# Altium schematic sheet FTDI.SchDoc: FTDI
size A4; Date: 30.05.2015; Author: G. Gajoch, M. Gumiela; DocumentNumber: 9; SheetNumber: 9; SheetTotal: 9; Model: EM1; PageSetup: Record=PageOptions|CenterHorizontal=True|CenterVertical=True|PrintScale=0.52|XCorrection=1.00|YCorrection=1.00|PrintKind=1|BorderSize=5000000|LeftOffset=0|BottomOffset=0|Orientation=2|PaperLength=4200|PaperWidth=2970|Scale=100|PaperSource=7|PrintQuality=600|MediaType=1|DitherType=10|PaperKind=A3|PrintScaleMode=1
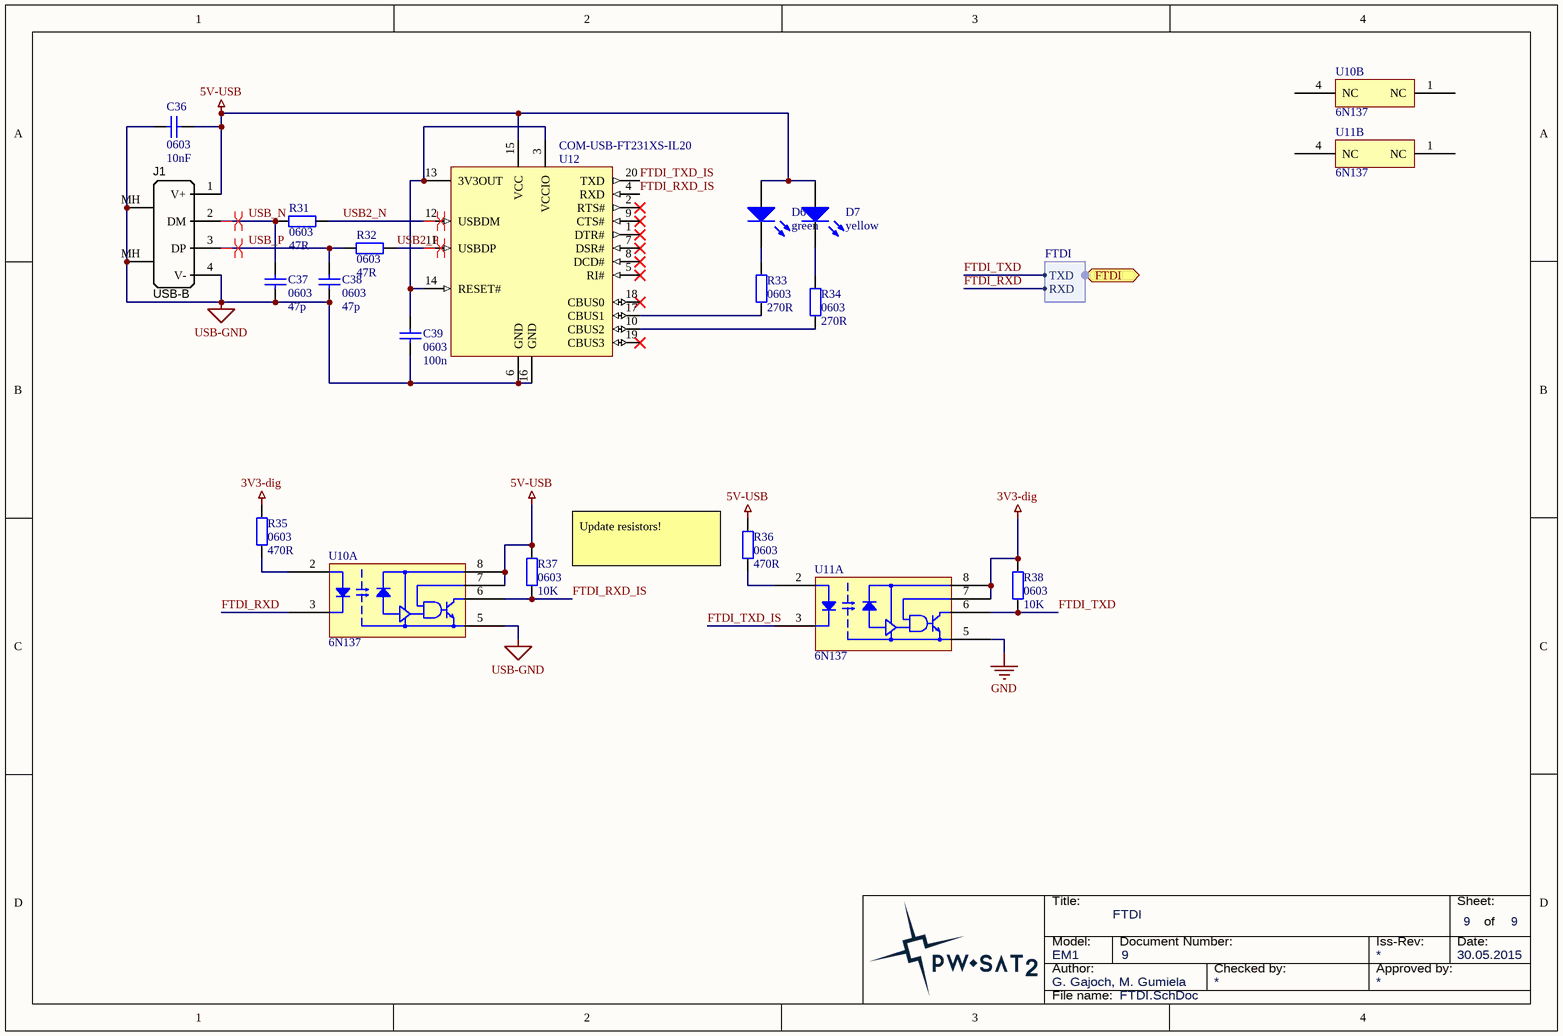
[diagram p0: FTDI.SchDoc]

## Parts
C36  0603  value 10nF  [SMD_Capacitor_0603]
C37  0603  value 47p  [SMD_Capacitor_0603]
C38  0603  value 47p  [SMD_Capacitor_0603]
C39  0603  value 100n  [SMD_Capacitor_0603]
D6  green  [LED 0805 GREEN]
D7  yellow  [LED 0805 Yellow]
J1  USB-B  [USB_TypeB_Tyco]
R31  0603  value 47R  [SMD_Resistor_0603]
R32  0603  value 47R  [SMD_Resistor_0603]
R33  0603  value 270R  [SMD_Resistor_0603]
R34  0603  value 270R  [SMD_Resistor_0603]
R35  0603  value 470R  [SMD_Resistor_0603]
R36  0603  value 470R  [SMD_Resistor_0603]
R37  0603  value 10K  [SMD_Resistor_0603]
R38  0603  value 10K  [SMD_Resistor_0603]
U10  6N137  [Surface Mount DIP 8-pin]  (parts A,B of 2)
U11  6N137  [Surface Mount DIP 8-pin]  (parts A,B of 2)
U12  COM-USB-FT231XS-IL20  [SSOP-20_L]

## Ports
FTDI (harness FTDI)

## Harnesses
FTDI: RXD, TXD

## Nets
3V3-dig: R35.2 R38.2 U11.7(Ve) U11.8(Vcc)
5V-USB: C36.1 D6.1(A) D7.1(A) J1.1(V+) R36.2 R37.2 U10.7(Ve) U10.8(Vcc) U12.15(VCC)
GND: U11.5(GND)
USB-GND: C36.2 C37.1 C38.1 C39.1 J1.4(V-) J1.MH(Shell) U10.5(GND) U12.6(GND) U12.16(GND)
FTDI_RXD: U10.3(-) ; port FTDI.RXD
FTDI_RXD_IS: R37.1 U10.6(Vo) U12.4(RXD)
FTDI_TXD: R38.1 U11.6(Vo) ; port FTDI.TXD
FTDI_TXD_IS: U11.3(-) U12.20(TXD)
USB2_N: R31.2 U12.12(USBDM)
USB2_P: R32.2 U12.11(USBDP)
USB_N: C37.2 J1.2(DM) R31.1
USB_P: C38.2 J1.3(DP) R32.1
NetC39_2: C39.2 U12.3(VCCIO) U12.13(3V3OUT) U12.14(RESET#)
NetD6_2: D6.2(K) R33.2
NetD7_2: D7.2(K) R34.2
NetR33_1: R33.1 U12.17(CBUS1)
NetR34_1: R34.1 U12.10(CBUS2)
NetR35_1: R35.1 U10.2(+)
NetR36_1: R36.1 U11.2(+)

Not connected (* = marked no-connect by the designer): U10 1(NC) 4(NC); U11 1(NC) 4(NC); U12 1(DTR#)* 2(RTS#)* 5(RI#)* 7(DSR#)* 8(DCD#)* 9(CTS#)* 18(CBUS0)* 19(CBUS3)*

## Layout directives
differential pair: USB2_N, USB2_P, USB_N, USB_P

## Notes on the sheet
- Update resistors!
- Title:
- Sheet:
- of
- Author:
- Model:
- Document Number:
- Checked by:
- Iss-Rev:
- Approved by:
- Date:
- File name:

## Library data of the parts
C36-C39 = Cap: Capacitor; Published: 8-Jun-2000; LatestRevisionDate: 17-Jul-2002; LatestRevisionNote: Re-released for DXP Platform.; PackageReference: RAD-0.3; Publisher: Altium Limited; PackageDescription: Radial Cap, Thru-Hole; 2 Leads; 0.3 in Pin Spacing
D6 D7 = LED2: Typical RED, GREEN, YELLOW, AMBER GaAs LED; Published: 8-Jun-2000; LatestRevisionDate: 17-Jul-2002; LatestRevisionNote: Re-released for DXP Platform.; PackageVersion: Feb-2002; PackageReference: 3.2X1.6X1.1; Publisher: Altium Limited; PackageDescription: SM LED; 2 Flat Leads
J1 = USB_TypeB: Connector THT Type B USB connector; Manufacturer Part Number 1: 292304-1; Manufacturer 1: TE Connectivity; Specifications: USB 2.0; SCDType: undef; Package / Case: R/A Type B; Supplier 1: Digi-Key; Connector Type: USB - B; Supplier Part Number 1: A31725-ND
R31-R38 = Res2: Resistor; Published: 8-Jun-2000; LatestRevisionDate: 17-Jul-2002; LatestRevisionNote: Re-released for DXP Platform.; PackageReference: AXIAL-0.4; Publisher: Altium Limited; PackageDescription: Axial Device, Thru-Hole; 2 Leads; 0.4 in Pin Spacing